# Altium schematic sheet EFUSE_TPS259250.SchDoc
size A3
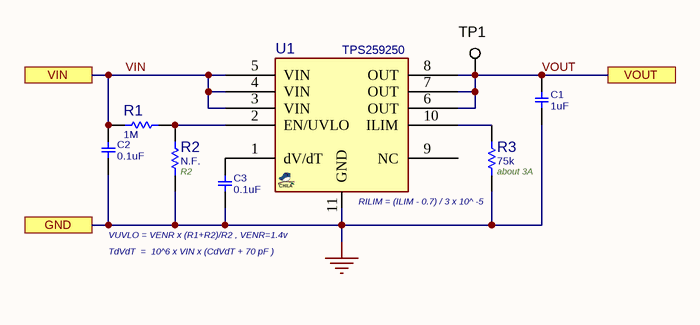
[diagram p0: EFUSE_TPS259250.SchDoc]

## Parts
C1  1uF  [C0402]
C2  0.1uF  [C0402]
C3  0.1uF  [C0402]
R1  1M  [R0402]
R2  N.F.  [R0402]
R3  75k  [R0402]
TP1  TESTPOINT_SMD  [TPSMD_S1]  (value not drawn)  (no BOM)
U1  TPS259250  [SON50_10T_3030]

## Ports
GND, VIN, VOUT

## Nets
GND: C1.1 C2.1 C3.1 R2.1 R3.1 U1.11(GND) ; port GND
VIN: C2.2 R1.1 U1.3(VIN) U1.4(VIN) U1.5(VIN) ; port VIN
VOUT: C1.2 TP1.1 U1.6(OUT) U1.7(OUT) U1.8(OUT) ; port VOUT
NetC3_2: C3.2 U1.1(dV/dT)
NetR1_2: R1.2 R2.2 U1.2(EN/UVLO)
NetR3_2: R3.2 U1.10(ILIM)

Not connected (* = marked no-connect by the designer): U1 9(NC)

## Notes on the sheet
- VUVLO = VENR x (R1+R2)/R2 , VENR=1.4v
- (near R2) R2
- (near U1) RILIM = (ILIM - 0.7) / 3 x 10^ -5
- (near R3) about 3A
- TdVdT  =  10^6 x VIN x (CdVdT + 70 pF )

## Library data of the parts
C1 = CAP_SMD_MLCC: CAP, MLCC; PARAM: X5R, 10%; MANF_P#: CL05A105KO5NNND; MANF: Samsung; PARAM2: 16v; PRICE: 50,000:	$0.006; ASSEMBLY: ASSEMBLY; VALUE: 1uF
C2 C3 = CAP_SMD_MLCC: CAP, MLCC; PARAM: X7R, 10%, -55~125oC; MANF_P#: GRM155R71H104KE14D; MANF: Murata; PARAM2: 50v; PRICE: 100: 0.018$; ASSEMBLY: ASSEMBLY; VALUE: 0.1uF
R1-R3 = RES_SMD: RESISTOR, SMD; PARAM: 0.063W; DESC: DESCRIPTION; DIST#: MOUSER; PARAM2: 1%; MANF_P#: -; MANF: -; ASSEMBLY: ASSEMBLY; PRICE: 100= 0.3$
  R1: VALUE: 1M
  R2: VALUE: N.F.
  R3: VALUE: 75k
TP1 = TESTPOINT_SMD: TEST POINT; MANF: MANF; MANF_P#: MANF_P#; VALUE: VALUE
U1 = TPS259250_SON10: LOAD SW, 5V eFuse, 5A, 4.5~5.5V, 30mOhm; MANF: TI; MANF_P#: TPS259250DRCR, TPS259250DRCT; PARAM: 5A, 5V, 30mOhm, -40~85oC; PRICE: 1.6$; VALUE: TPS259250